# Altium schematic sheet [0x] - DOC REVISION HISTORY.SchDoc
size A3; DocumentNumber: 3; SheetNumber: 3; SheetTotal: 4
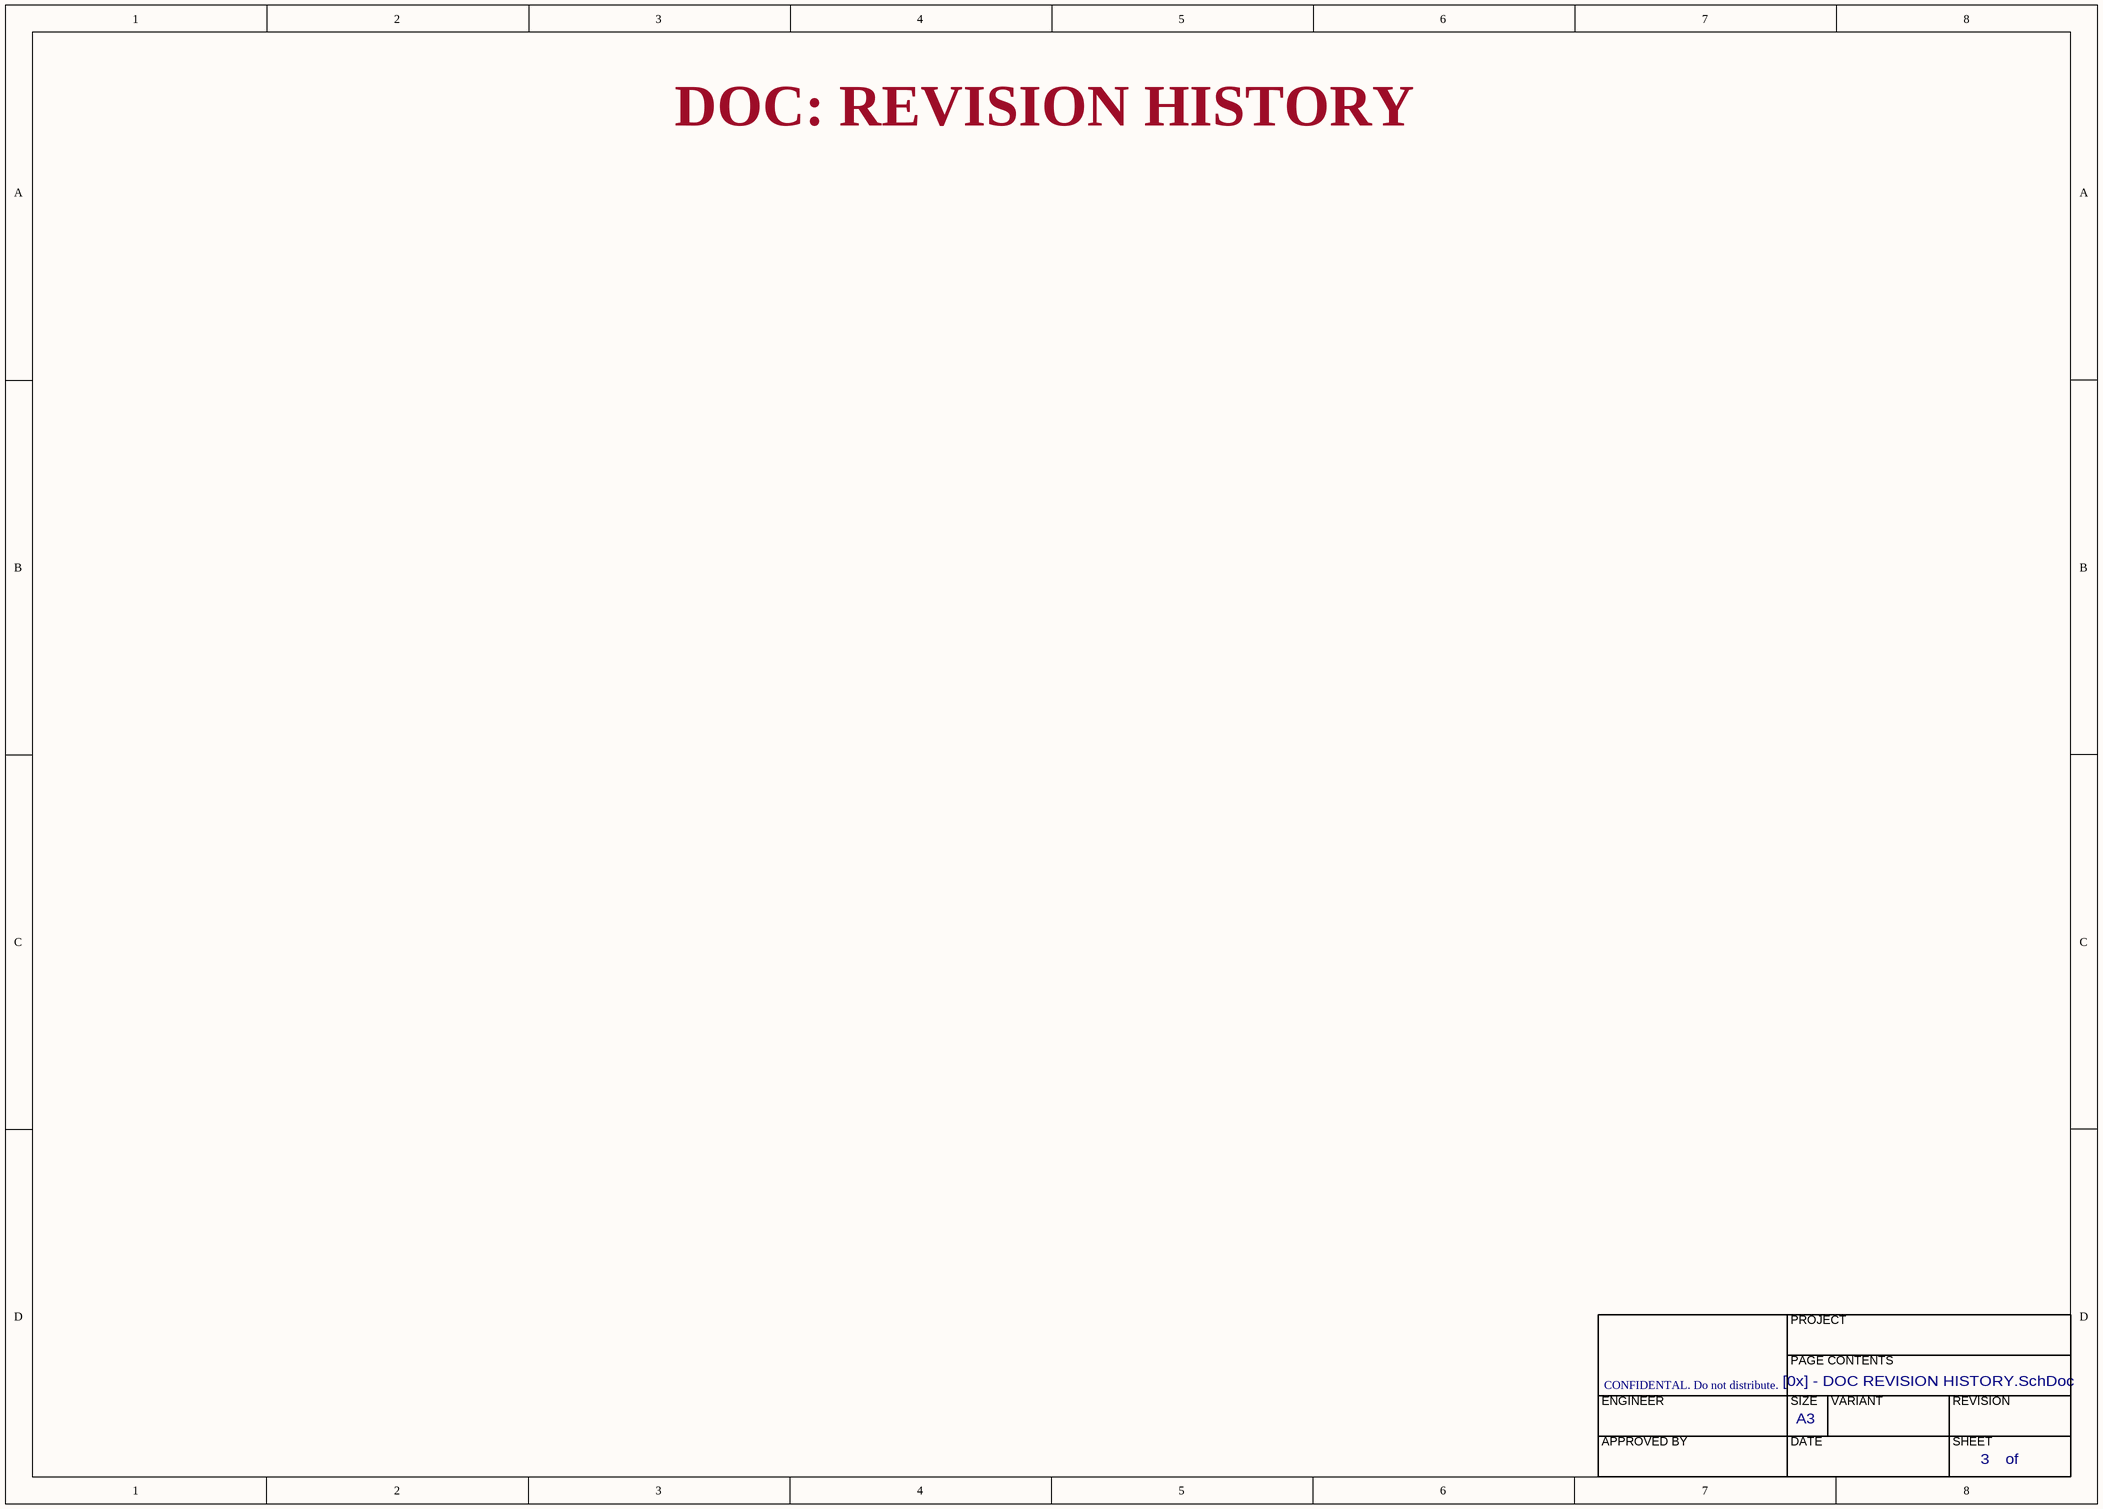
[diagram p0: [0x] - DOC REVISION HISTORY.SchDoc]

## Notes on the sheet
- DOC: REVISION HISTORY
- PROJECT
- CLOCKS (CPU & PCIE)
- CONFIDENTAL. Do not distribute.
- PAGE CONTENTS
- ENGINEER
- APPROVED BY
- SIZE
- DATE
- A3
- VARIANT
- REVISION
- SHEET
- of